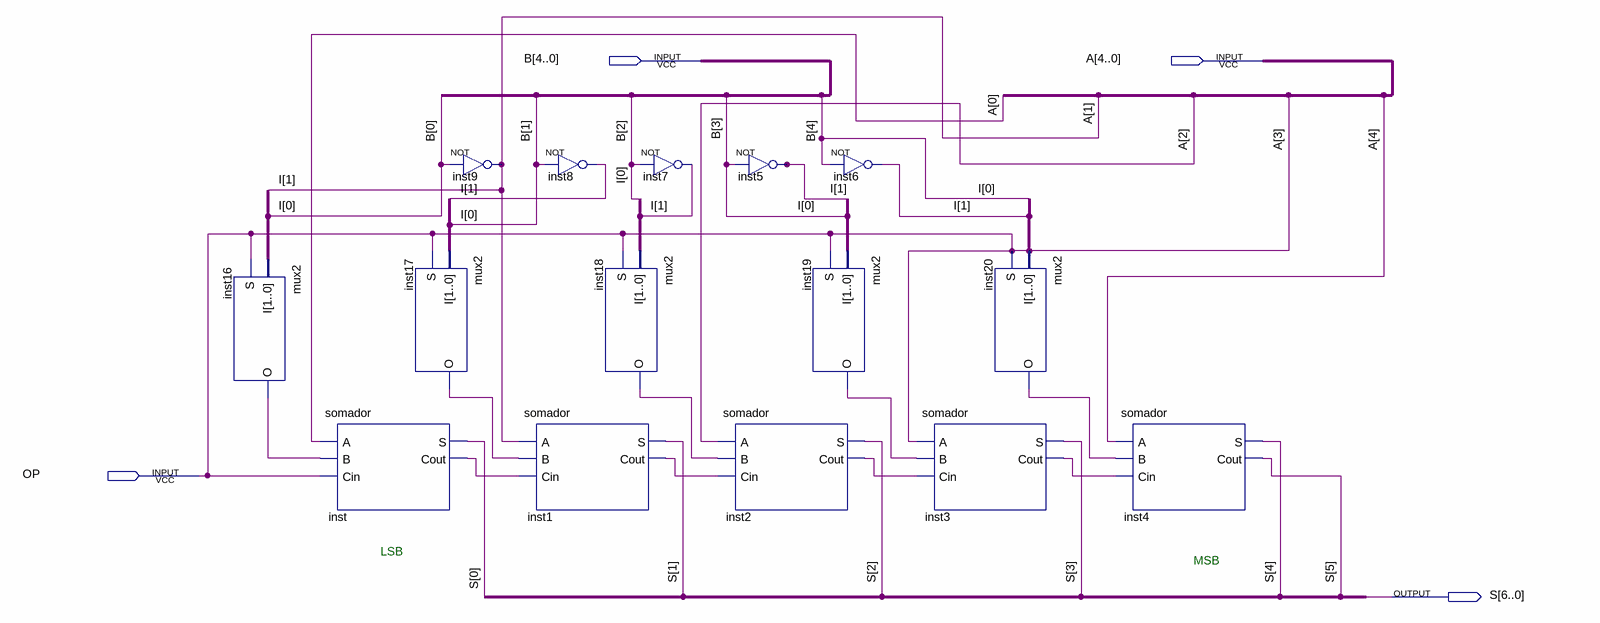
[diagram p0: schematic sheet]
// Quartus schematic ula.bdf as structural Verilog: 15 symbols, 4 pins
module ula (
  input  [4:0] B,
  input  [4:0] A,
  input  OP,
  output [6:0] S
);

  wire inst1_cout, inst2_cout, inst3_cout, inst16_o, inst17_o, inst18_o, inst19_o, inst20_o, inst_cout;
  wire [1:0] undriven, undriven_2, undriven_3, undriven_4, undriven_5;

  mux2 inst16 (.I(undriven), .S(OP), .O(inst16_o));
  somador inst (.A(A[0]), .B(inst16_o), .Cin(OP), .S(S[0]), .Cout(inst_cout));
  mux2 inst17 (.I(undriven_2), .S(OP), .O(inst17_o));
  not inst9 (A[1], B[4]);
  not inst8 (A[1], B[4]);
  somador inst1 (.A(A[1]), .B(inst17_o), .Cin(inst_cout), .S(S[1]), .Cout(inst1_cout));
  mux2 inst18 (.I(undriven_3), .S(OP), .O(inst18_o));
  not inst7 (A[1], B[4]);
  not inst5 (A[1], B[4]);
  somador inst2 (.A(A[2]), .B(inst18_o), .Cin(inst1_cout), .S(S[2]), .Cout(inst2_cout));
  not inst6 (A[1], B[4]);
  mux2 inst19 (.I(undriven_4), .S(OP), .O(inst19_o));
  mux2 inst20 (.I(undriven_5), .S(OP), .O(inst20_o));
  somador inst3 (.A(OP), .B(inst19_o), .Cin(inst2_cout), .S(S[3]), .Cout(inst3_cout));
  somador inst4 (.A(A[4]), .B(inst20_o), .Cin(inst3_cout), .S(S[4]), .Cout(S[5]));

  assign B[3:0] = {4{B[4]}};

  // Other names for the same wires on the sheet: I[1:0] = {A[1], B[4]}

  // Notes on the sheet:
  //   LSB
  //   MSB
endmodule
